# Altium schematic sheet HumNet.SchDoc
size A4
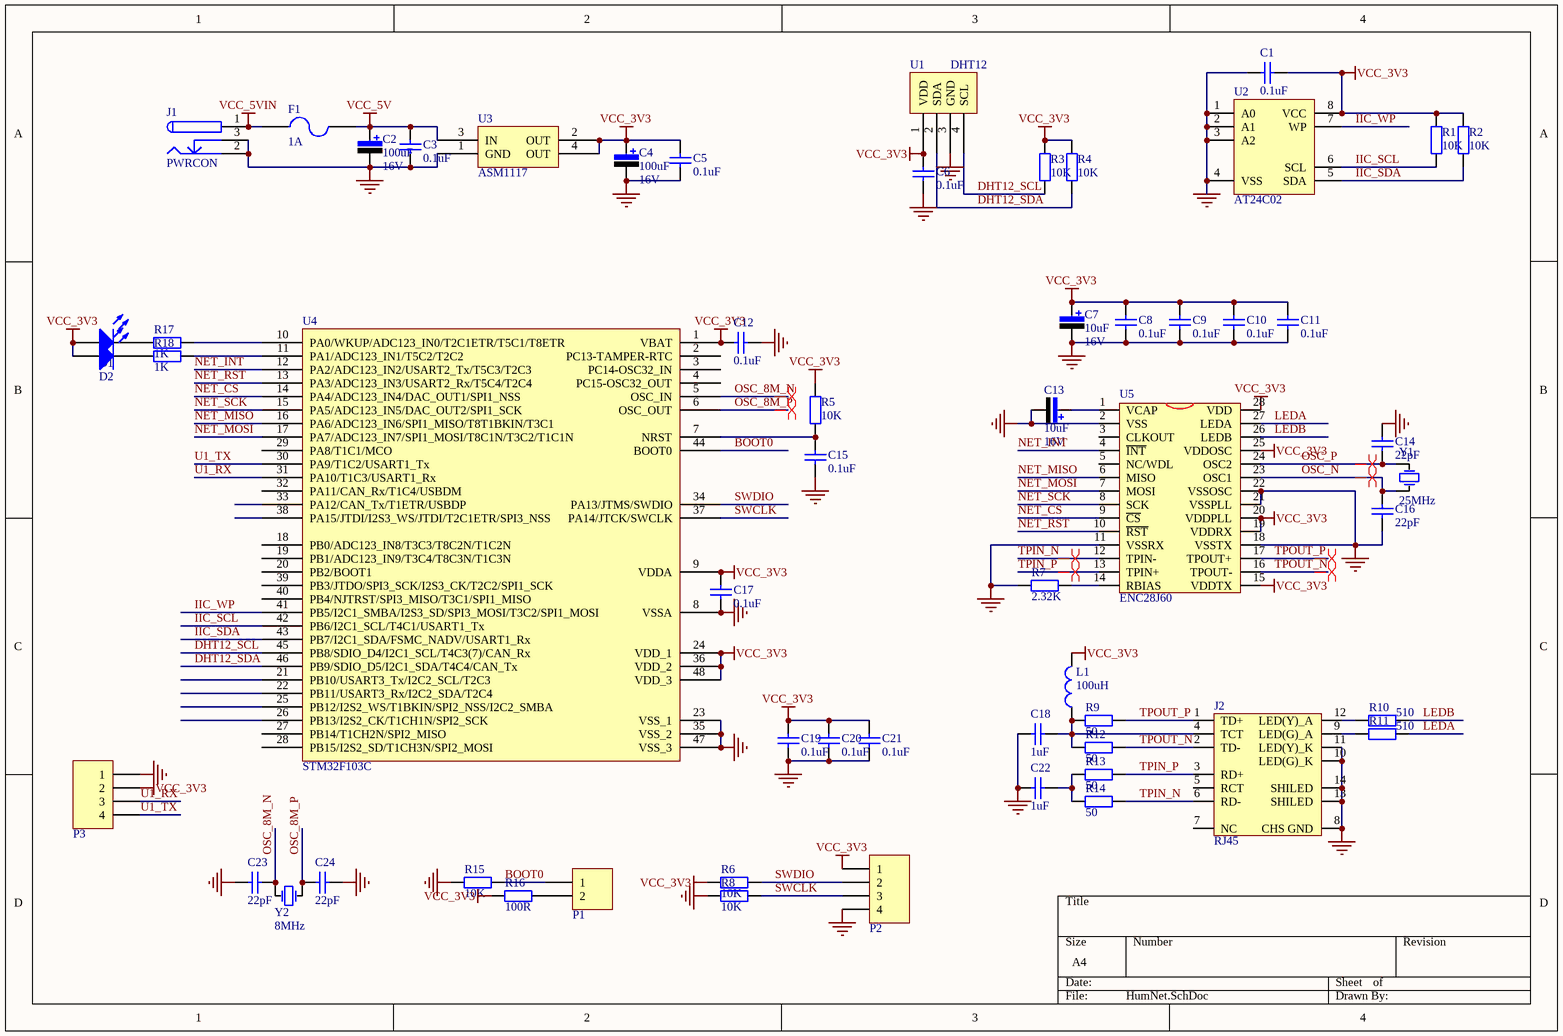
[diagram p0: HumNet.SchDoc]

## Parts
C1  value 0.1uF  [C-RAD-0603]  (hidden comment: Cap)
C2  value 100uF  Vol: 16V  [CAP-3528]  (hidden comment: Cap Pol)
C3  value 0.1uF  [C-RAD-0603]  (hidden comment: Cap)
C4  value 100uF  Vol: 16V  [CAP-3528]  (hidden comment: Cap Pol)
C5  value 0.1uF  [C-RAD-0603]  (hidden comment: Cap)
C6  value 0.1uF  [C-RAD-0603]  (hidden comment: Cap)
C7  value 10uF  Vol: 16V  [CAP-3528]  (hidden comment: Cap Pol)
C8  value 0.1uF  [C-RAD-0603]  (hidden comment: Cap)
C9  value 0.1uF  [C-RAD-0603]  (hidden comment: Cap)
C10  value 0.1uF  [C-RAD-0603]  (hidden comment: Cap)
C11  value 0.1uF  [C-RAD-0603]  (hidden comment: Cap)
C12  value 0.1uF  [C-RAD-0603]  (hidden comment: Cap)
C13  value 10uF  Vol: 16V  [CAP-3528]  (hidden comment: Cap Pol)
C14  value 22pF  [C-RAD-0603]  (hidden comment: Cap)
C15  value 0.1uF  [C-RAD-0603]  (hidden comment: Cap)
C16  value 22pF  [C-RAD-0603]  (hidden comment: Cap)
C17  value 0.1uF  [C-RAD-0603]  (hidden comment: Cap)
C18  value 1uF  [C-RAD-0603]  (hidden comment: Cap)
C19  value 0.1uF  [C-RAD-0603]  (hidden comment: Cap)
C20  value 0.1uF  [C-RAD-0603]  (hidden comment: Cap)
C21  value 0.1uF  [C-RAD-0603]  (hidden comment: Cap)
C22  value 1uF  [C-RAD-0603]  (hidden comment: Cap)
C23  value 22pF  [C-RAD-0603]  (hidden comment: Cap)
C24  value 22pF  [C-RAD-0603]  (hidden comment: Cap)
D1  LED0  [LED_0805]  (value not drawn)
D2  LED0  [LED_0805]  (value not drawn)
F1  value 1A  [1812]  (hidden comment: Fuse)
J1  PWRCON  [DC-005]
J2  RJ45  [HR911105A]
L1  value 100uH  [1206]  (hidden comment: Inductor)
P1  Header 2  [HDR2X1_A]  (value not drawn)
P2  Header 4  [HDR4X1_A]  (value not drawn)
P3  Header 4  [HDR4X1_A]  (value not drawn)
R1  value 10K  [0603-1]  (hidden comment: Res1)
R2  value 10K  [0603-1]  (hidden comment: Res1)
R3  value 10K  [0603-1]  (hidden comment: Res1)
R4  value 10K  [0603-1]  (hidden comment: Res1)
R5  value 10K  [0603-1]  (hidden comment: Res1)
R6  value 10K  [0603-1]  (hidden comment: Res1)
R7  value 2.32K  [0603-1]  (hidden comment: Res1)
R8  value 10K  [0603-1]  (hidden comment: Res1)
R9  value 50  [0603-1]  (hidden comment: Res1)
R10  value 510  [0603-1]  (hidden comment: Res1)
R11  value 510  [0603-1]  (hidden comment: Res1)
R12  value 50  [0603-1]  (hidden comment: Res1)
R13  value 50  [0603-1]  (hidden comment: Res1)
R14  value 50  [0603-1]  (hidden comment: Res1)
R15  value 10K  [0603-1]  (hidden comment: Res1)
R16  value 100R  [0603-1]  (hidden comment: Res1)
R17  value 1K  [0603-1]  (hidden comment: Res1)
R18  value 1K  [0603-1]  (hidden comment: Res1)
U1  DHT12  [DHT11]
U2  AT24C02  [SOIC8_N]
U3  ASM1117  [SOT-223]
U4  STM32F103C  [LQFP-48_M]
U5  ENC28J60  [SSOP28]
Y1  value 25MHz  [X-SM49]  (hidden comment: XTAL)
Y2  value 8MHz  [X-SM49]  (hidden comment: XTAL)

## Nets
GND: C1.1 C2.2 C3.1 C4.2 C5.1 C6.1 C7.2 C8.1 C9.1 C10.1 C11.1 C12.1 C13.2 C14.1 C15.1 C16.2 C17.1 C18.2 C19.1 C20.1 C21.1 C22.2 C23.1 C24.2 J1.2 J1.3 J2.8(CHS_GND) J2.10(LED(G)_K) J2.11(LED(Y)_K) J2.13(SHILED) J2.14(SHILED) P2.4 P3.1 R7.1 R8.1 R15.1 U1.3(GND) U2.1(A0) U2.2(A1) U2.3(A2) U2.4(VSS) U3.1(GND) U4.8(VSSA) U4.23(VSS_1) U4.35(VSS_2) U4.47(VSS_3) U5.2(VSS) U5.11(VSSRX) U5.18(VSSTX) U5.21(VSSPLL) U5.22(VSSOSC)
VCC_3V3: C1.2 C4.1 C5.2 C6.2 C7.1 C8.2 C9.2 C10.2 C11.2 C12.2 C17.2 C19.2 C20.2 C21.2 D1.1(A) D2.1(A) L1.2 P2.1 P3.2 R1.2 R2.2 R3.2 R4.2 R5.2 R6.1 R16.1 U1.1(VDD) U2.8(VCC) U3.2(OUT) U3.4(OUT) U4.1(VBAT) U4.9(VDDA) U4.24(VDD_1) U4.36(VDD_2) U4.48(VDD_3) U5.15(VDDTX) U5.19(VDDRX) U5.20(VDDPLL) U5.25(VDDOSC) U5.28(VDD)
VCC_5V: C2.1 C3.2 F1.2 U3.3(IN)
VCC_5VIN: F1.1 J1.1
BOOT0: P1.1 R15.2 U4.44(BOOT0)
DHT12_SCL: R3.1 U1.4(SCL) U4.45(PB8/SDIO_D4/I2C1_SCL/T4C3(7)/CAN_Rx)
DHT12_SDA: R4.1 U1.2(SDA) U4.46(PB9/SDIO_D5/I2C1_SDA/T4C4/CAN_Tx)
IIC_SCL: R1.1 U2.6(SCL) U4.42(PB6/I2C1_SCL/T4C1/USART1_Tx)
IIC_SDA: R2.1 U2.5(SDA) U4.43(PB7/I2C1_SDA/FSMC_NADV/USART1_Rx)
IIC_WP: U2.7(WP) U4.41(PB5/I2C1_SMBA/I2S3_SD/SPI3_MOSI/T3C2/SPI1_MOSI)
LEDA: R11.2 U5.27(LEDA)
LEDB: R10.2 U5.26(LEDB)
NET_CS: U4.14(PA4/ADC123_IN4/DAC_OUT1/SPI1_NSS) U5.9(~{CS})
NET_INT: U4.12(PA2/ADC123_IN2/USART2_Tx/T5C3/T2C3) U5.4(~{INT})
NET_MISO: U4.16(PA6/ADC123_IN6/SPI1_MISO/T8T1BKIN/T3C1) U5.6(MISO)
NET_MOSI: U4.17(PA7/ADC123_IN7/SPI1_MOSI/T8C1N/T3C2/T1C1N) U5.7(MOSI)
NET_RST: U4.13(PA3/ADC123_IN3/USART2_Rx/T5C4/T2C4) U5.10(~{RST})
NET_SCK: U4.15(PA5/ADC123_IN5/DAC_OUT2/SPI1_SCK) U5.8(SCK)
OSC_8M_N: C23.2 U4.5(OSC_IN) Y2.2(OSC2)
OSC_8M_P: C24.1 U4.6(OSC_OUT) Y2.1(OSC1)
OSC_N: C16.1 U5.23(OSC1) Y1.2(OSC2)
OSC_P: C14.2 U5.24(OSC2) Y1.1(OSC1)
SWCLK: P2.3 R8.2 U4.37(PA14/JTCK/SWCLK)
SWDIO: P2.2 R6.2 U4.34(PA13/JTMS/SWDIO)
TPIN_N: J2.6(RD-) R14.2 U5.12(TPIN-)
TPIN_P: J2.3(RD+) R13.2 U5.13(TPIN+)
TPOUT_N: J2.2(TD-) R12.2 U5.16(TPOUT-)
TPOUT_P: J2.1(TD+) R9.2 U5.17(TPOUT+)
U1_RX: P3.3 U4.31(PA10/T1C3/USART1_Rx)
U1_TX: P3.4 U4.30(PA9/T1C2/USART1_Tx)
NetC13_1: C13.1 U5.1(VCAP)
NetC15_2: C15.2 R5.1 U4.7(NRST)
NetC18_1: C18.1 J2.4(TCT) L1.1 R9.1 R12.1
NetC22_1: C22.1 R13.1 R14.1
NetD1_2: D1.2(K) R17.1
NetD2_2: D2.2(K) R18.1
NetJ2_9: J2.9(LED(G)_A) R11.1
NetJ2_12: J2.12(LED(Y)_A) R10.1
NetP1_2: P1.2 R16.2
NetR7_2: R7.2 U5.14(RBIAS)
NetR17_2: R17.2 U4.10(PA0/WKUP/ADC123_IN0/T2C1ETR/T5C1/T8ETR)
NetR18_2: R18.2 U4.11(PA1/ADC123_IN1/T5C2/T2C2)

Not connected (* = marked no-connect by the designer): J2 5(RCT) 7(NC); U4 2(PC13-TAMPER-RTC) 3(PC14-OSC32_IN) 4(PC15-OSC32_OUT) 18(PB0/ADC123_IN8/T3C3/T8C2N/T1C2N) 19(PB1/ADC123_IN9/T3C4/T8C3N/T1C3N) 20(PB2/BOOT1) 21(PB10/USART3_Tx/I2C2_SCL/T2C3) 22(PB11/USART3_Rx/I2C2_SDA/T2C4) 25(PB12/I2S2_WS/T1BKIN/SPI2_NSS/I2C2_SMBA) 26(PB13/I2S2_CK/T1CH1N/SPI2_SCK) 27(PB14/T1CH2N/SPI2_MISO) 28(PB15/I2S2_SD/T1CH3N/SPI2_MOSI) 29(PA8/T1C1/MCO) 32(PA11/CAN_Rx/T1C4/USBDM) 33(PA12/CAN_Tx/T1ETR/USBDP) 38(PA15/JTDI/I2S3_WS/JTDI/T2C1ETR/SPI3_NSS) 39(PB3/JTDO/SPI3_SCK/I2S3_CK/T2C2/SPI1_SCK) 40(PB4/NJTRST/SPI3_MISO/T3C1/SPI1_MISO); U5 3(CLKOUT) 5(NC/WDL)

## Layout directives
differential pair: OSC_8M_N, OSC_8M_P, OSC_N, OSC_P, TPIN_N, TPIN_P, TPOUT_N, TPOUT_P

## Library data of the parts
C1 C3 C5 C6 C8-C12 C14-C24 = Cap: 无极性电容; Published: 8-Jun-2000; LatestRevisionDate: 17-Jul-2002; LatestRevisionNote: Re-released for DXP Platform.; PackageReference: RAD-0.3; Publisher: Altium Limited
C2 C4 C7 C13 = Cap Pol: 极性电解电容; Published: 8-Jun-2000; LatestRevisionDate: 17-Jul-2002; LatestRevisionNote: Re-released for DXP Platform.; PackageReference: RB7.6-15; Publisher: Altium Limited
D1 D2 = LED0: 发光二极管; Published: 8-Jun-2000; LatestRevisionDate: 08-Jul-2005; LatestRevisionNote: Mech Layer 1 removed.; PackageReference: LED-0; Publisher: Altium Limited
F1 = Fuse 2: 保险丝; Published: 8-Jun-2000; LatestRevisionDate: 17-Jul-2002; LatestRevisionNote: Re-released for DXP Platform.; PackageReference: PIN-W2/E2.8; Publisher: Altium Limited
J1 = PWRCON: 直流电源端子; Published: 17-Dec-2003; DatasheetDocument: 09-May-2002; Publisher: Altium Limited; ComponentLink1Description: Manufacturer Link; ComponentLink1URL: http://domino.kycon.com/internet/Products.html
J2 = HR911105
L1 = Inductor: 电感; Code_IEC: 1005; Published: 8-Jun-2000; LatestRevisionDate: 17-Jul-2002; LatestRevisionNote: Re-released for DXP Platform.; PackageReference: 0402-A; Publisher: Altium Limited; Code_JEITA: 0402
P1 = Header 2: 接插件; LatestRevisionDate: 17-Jul-2002; LatestRevisionNote: Re-released for DXP Platform.; Publisher: Altium Limited
P2 P3 = Header 4: 接插件; LatestRevisionDate: 17-Jul-2002; LatestRevisionNote: Re-released for DXP Platform.; Publisher: Altium Limited
R1-R18 = Res1: 贴片电阻; Published: 8-Jun-2000; LatestRevisionDate: 17-Jul-2002; LatestRevisionNote: Re-released for DXP Platform.; PackageReference: AXIAL-0.4; Publisher: Altium Limited
U2 = AT24C02: EEROM存储器
U3 = ASM1117: 3.3V稳压芯片
U4 = STM32F103C: STM32单片机48引脚
Y1 Y2 = XTAL: 晶振; Published: 8-Jun-2000; LatestRevisionDate: 17-Jul-2002; LatestRevisionNote: Re-released for DXP Platform.; PackageReference: R38; Publisher: Altium Limited